# EAGLE design LMD18200 (EAGLE 7.6.0)
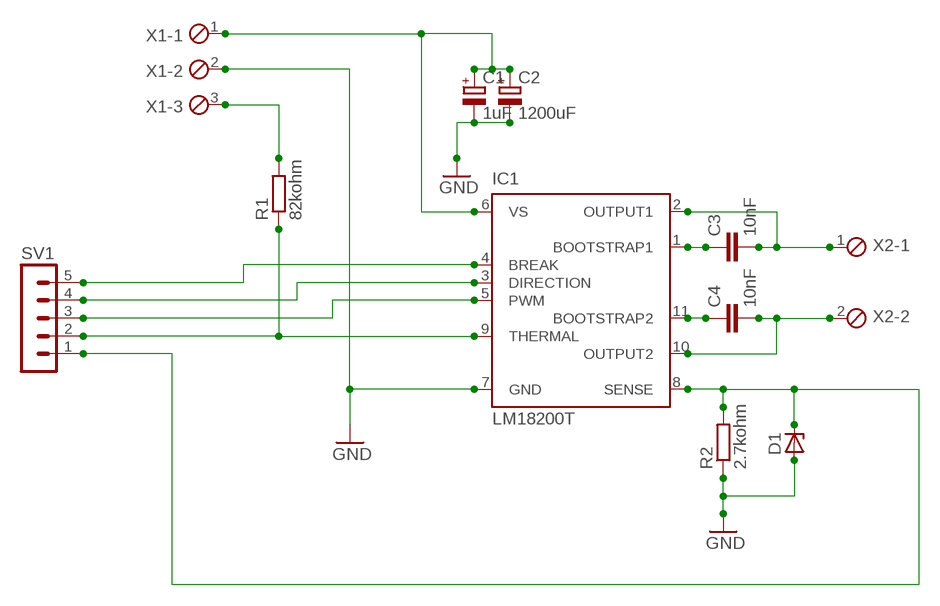
[diagram p0: schematic, sheet 1]

## Parts
C1  1uF  CPOL-EUE2,5-6E  [E2,5-6E]
C2  1200uF  CPOL-EUE5-13  [E5-13]
C3  10nF  C-EU025-024X044  [C025-024X044]
C4  10nF  C-EU025-024X044  [C025-024X044]
D1  ZENER-DIODEZD-5  [ZDIO-5]
IC1  LM18200T  [TO-220-11]
R1  82kohm  R-EU_0204/5  [0204/5]
R2  2.7kohm  R-EU_0204/5  [0204/5]
SV1  MA05-1  [MA05-1]
X1  MPT3  [3POL254]
X2  MPT2  [2POL254]

## Nets
GND: C1.- C2.- D1.A IC1.7(GND) R2.1 X1.2
N$1: IC1.4(BREAK) SV1.5
N$2: IC1.3(DIRECTION) SV1.4
N$3: IC1.5(PWM) SV1.3
N$4: C3.1 IC1.1(BOOTSTRAP1)
N$5: C1.+ C2.+ IC1.6(VS) X1.1
N$6: IC1.9(THERMAL) R1.1 SV1.2
N$7: R1.2 X1.3
N$8: C3.2 IC1.2(OUTPUT1) X2.1
N$9: C4.2 IC1.10(OUTPUT2) X2.2
N$10: D1.C IC1.8(SENSE) R2.2 SV1.1
N$11: C4.1 IC1.11(BOOTSTRAP2)

## Library data of the parts
C1 C2 = resistor:CPOL-EU: POLARIZED CAPACITOR, European symbol
C3 C4 = rcl:C-EU: CAPACITOR, European symbol
D1 = diode:ZENER-DIODE: Z-Diode
IC1 = national-semiconductor:LM18200T: 3A, 55V H-Bridge Motor Control SourcE: http://cache.national.com/ds/LM/LMD18200.pdf; OC_FARNELL: unknown; OC_NEWARK: unknown
R1 R2 = rcl:R-EU_: RESISTOR, European symbol
SV1 = con-lstb:MA05-1: PIN HEADER; OC_FARNELL: unknown; OC_NEWARK: unknown
X1 = con-phoenix-254:MPT3: PHOENIX CONNECTOR; OC_FARNELL: unknown; OC_NEWARK: unknown
X2 = con-phoenix-254:MPT2: PHOENIX CONNECTOR; OC_FARNELL: unknown; OC_NEWARK: unknown

## Board
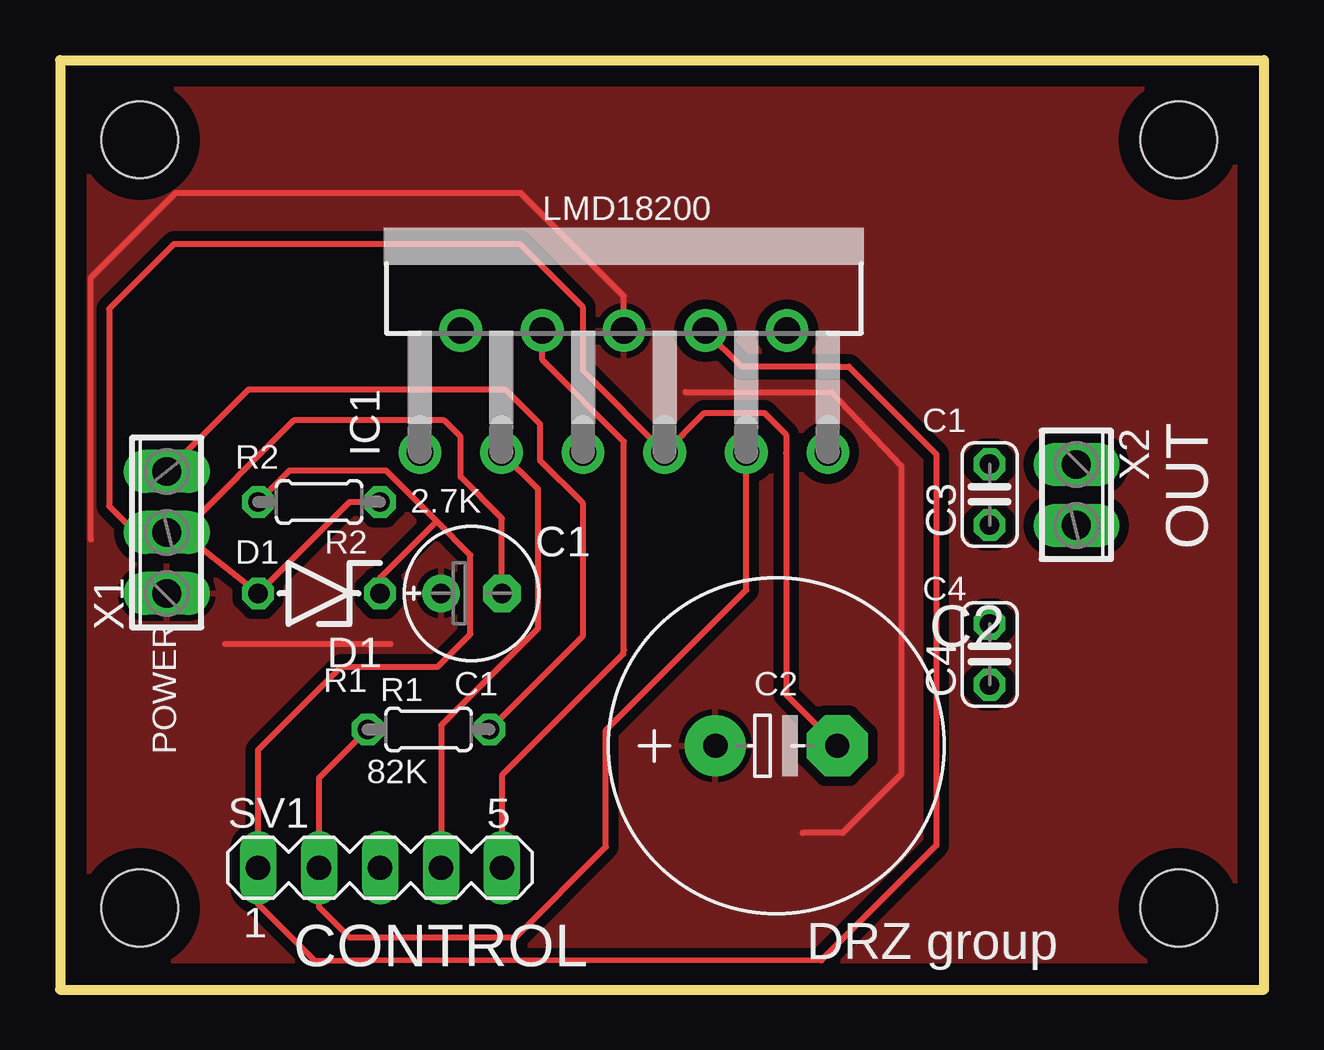
[diagram p1: board, top side]
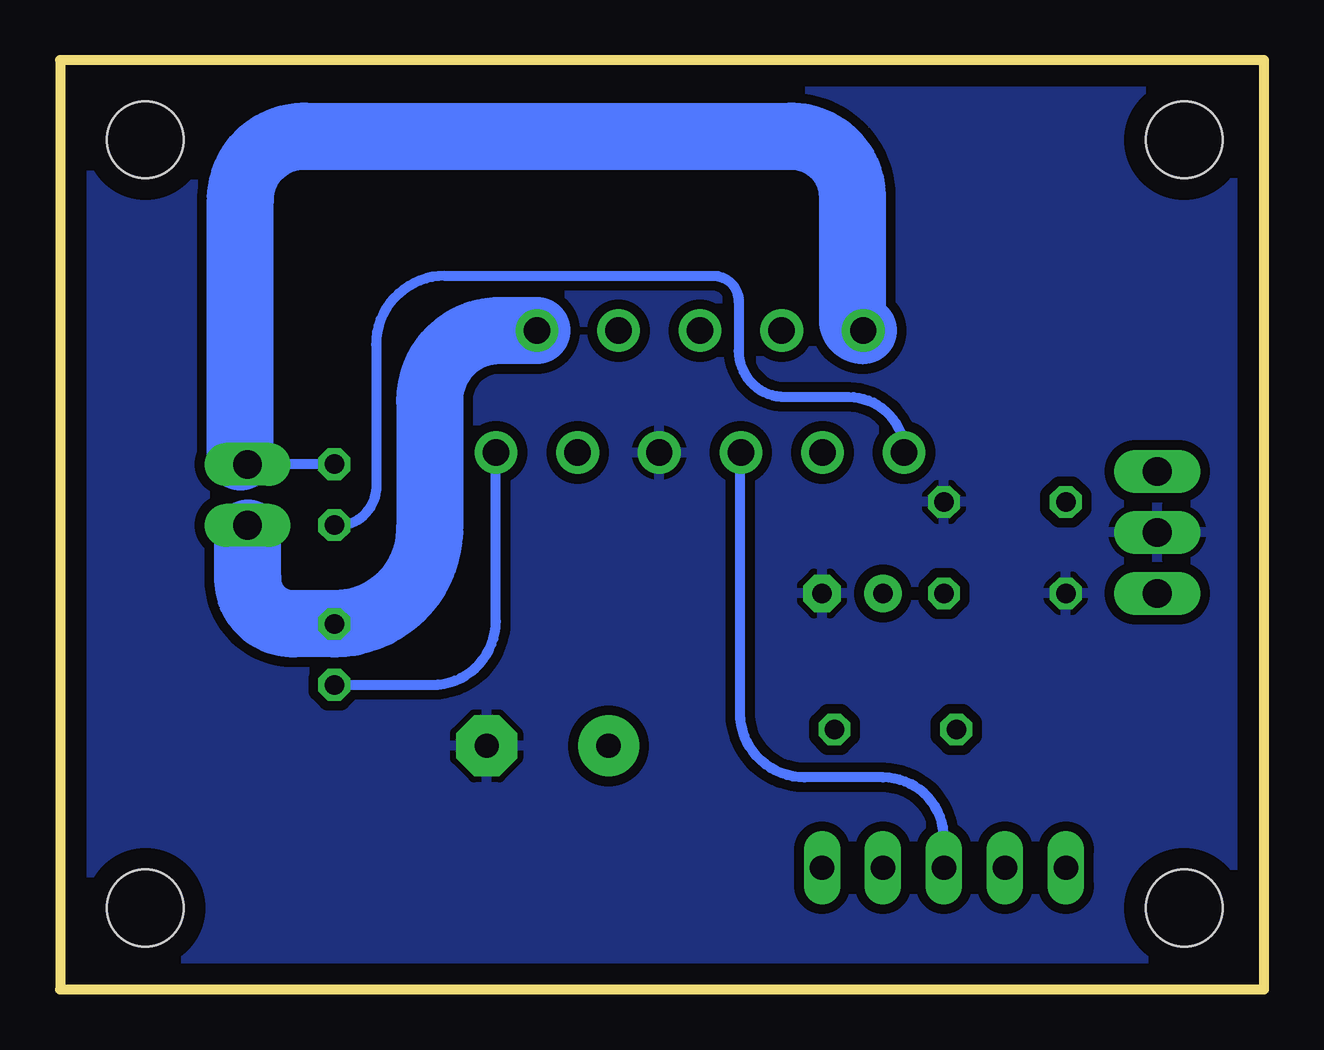
[diagram p2: board, bottom side, seen from below]

Size 50.17 x 38.73 mm. Coordinates in mm from the lower left corner, seen from the top.
Outline: 0,38.73 0,0 50.17,0 50.17,38.73 0,38.73
Copper layers (1*16): Top 0.035mm / dielectric 1.5mm / Bottom 0.035mm
Design rules "default *": minimum track width 10mil, minimum drill 24mil, track to track 8mil, track to pad 8mil, pad to pad 8mil, via to via 8mil, smd to smd 0mil, copper to edge 35mil, drill to drill 8mil, minimum pad ring 10mil, minimum via ring 8mil, stop-mask expansion 4mil, vias tented up to drill 0mil, thermal gap 10mil
Holes 3.2 mm at 3.33,35.41 46.61,35.41 46.61,3.4 3.33,3.4

### Footprints (pad centres in the part's own frame; a part is rotated, then mirrored left to right if it is on the bottom)
E2,5-6E = drill 0.813 pad 1.575: + -1.27,0 | drill 0.813 pad 1.575 octagon: - 1.27,0
E5-13 = drill 1.016 pad 2.54: + -2.54,0 | drill 1.016 pad 2.54 octagon: - 2.54,0
C025-024X044 = drill 0.813 octagon: 1 -1.27,0; 2 1.27,0
ZDIO-5 = drill 0.813 octagon: A 2.54,0; C -2.54,0
TO-220-11 = drill 1.1 pad 1.778: 1 -8.5,-9.37; 2 -6.8,-4.29; 3 -5.1,-9.37; 4 -3.4,-4.29; 5 -1.7,-9.37; 6 0,-4.29; 7 1.7,-9.37; 8 3.4,-4.29; 9 5.1,-9.37; 10 6.8,-4.29; 11 8.5,-9.37
0204/5 = drill 0.813 octagon: 1 -2.54,0; 2 2.54,0
MA05-1 = drill 1.016 long: 1 -5.08,0; 2 -2.54,0; 3 0,0; 4 2.54,0; 5 5.08,0
3POL254 = drill 1.2 long: 1 -2.54,0; 2 0,0; 3 2.54,0
2POL254 = drill 1.2 long: 1 -1.27,0; 2 1.27,0

### Placement (x,y rotation side)
C1  17.14,16.51 0 top
C2  29.84,10.16 0 top
C3  38.73,20.62 90 top
C4  38.73,13.97 90 top
D1  10.8,16.51 180 top
IC1  23.5,31.75 0 top
R1  15.36,10.84 0 top
R2  10.8,20.32 180 top
SV1  13.34,5.08 0 top
X1  4.45,19.05 90 top
X2  42.35,20.61 270 top

### Tracks (layer width: path | path; a pad name or v marks a point on that pad's centre or on a via)
GND
  Top 0.254: 30.26,22.33 30.26,22.42 | 30.26,22.33 30.25,22.34 30.25,23.12 29.34,24.04 26.85,24.04 IC1.7 21.77,25.8 21.77,28.46 19.16,31.08 4.75,31.08 2.05,28.37 2.05,20.15 3.14,19.05 X1.2 5.06,19.04 | C1.- 18.42,19.64 16.69,21.37 16.7,21.37 16.7,23.03 16.01,23.72 9.74,23.72 5.06,19.04 | R2.1 12.06,20.32 D1.A 5.06,19.04 | 30.26,22.33 30.26,12.28 C2.-
  pour Bottom (isolate 0.406): 0,0 0,38.73 50.17,38.73 50.17,0
N$1
  Top 0.254: SV1.5 18.42,8.93 23.48,13.99 23.5,14.14 23.5,22.83 20.09,26.23 IC1.4
N$2
  Top 0.254: 18.42,22.38 IC1.3 19.92,20.85 19.92,15.06 15.88,11.01 SV1.4
N$3
  Bottom 0.406: SV1.3 13.34,6.31 arc-90 15.87,8.84 19.14,8.84 arc90 21.83,11.54 21.83,22.34 arc90 IC1.5
N$4
  Bottom 0.406: C3.1 arc-90 37,20.79 37,26.88 arc90 34.13,29.74 22.95,29.74 arc90 21.89,28.68 21.89,26.62 arc-90 19.97,24.7 17.31,24.7 arc90 IC1.1
N$5
  Top 0.254: 26.06,24.89 32.15,24.89 35.04,21.84 35.04,8.97 32.61,6.53 30.94,6.53 | 3.53,16.51 X1.1 4.77,16.51 | 6.87,14.41 13.77,14.41 | IC1.6 23.5,28.89 19.2,33.19 4.81,33.19 1.28,29.66 1.28,18.76
  pour Top (isolate 0.406): -0.03,38.76 50.27,38.76 50.27,0.05 -0.03,0.05
N$6
  Top 0.254: IC1.9 28.59,16.66 22.75,10.81 22.75,5.94 18.97,2.17 12.07,2.17 10.8,3.44 SV1.2 10.8,8.82 R1.1
N$7
  Top 0.254: R1.2 21.78,14.72 21.78,20.28 20,22.06 20,23.58 18.57,25 8.79,25 7.85,25 X1.3
N$8
  Bottom 0.406: 42.65,22.18 arc-90 X2.1 arc90 42.34,21.89 C3.2
  Bottom 2.794: IC1.2 arc90 17.14,27.91 17.14,33.02 arc-90 19.69,35.56 40,35.56 arc-90 42.65,32.92 42.65,22.18
N$9
  Bottom 0.406: 42.34,19.03 arc-90 X2.2
  Bottom 2.794: IC1.10 31.86,27.46 arc-90 34.77,24.56 34.77,19.21 arc90 C4.2 40.46,15.24 arc90 42.34,17.12 42.34,19.03
N$10
  Top 0.254: 11.98,1.21 31.72,1.22 36.52,6.02 36.52,22.31 32.87,25.96 32.5,25.96 30.52,25.96 28.6,25.95 28.4,25.95 IC1.8 | 11.98,1.21 11.84,1.21 | 11.98,1.21 10.6,1.22 8.25,3.56 SV1.1 8.25,9.99 11.71,13.45 15.74,13.45 17.1,14.81 17.1,18.1 15.69,19.52 | R2.2 9.57,21.63 13.57,21.63 15.69,19.52 | D1.C 13.34,17.16 15.69,19.52
N$11
  Bottom 0.406: C4.1 34.66,12.7 arc-90 32.01,15.35 32.01,22.37 arc90 IC1.11

### Text on the board
tPlace: LMD18200 | C1 | R2 | 2.7K | OUT | D1 | C4 | R1 | C1 | C2 | POWER | 82K | CONTROL | DRZ group